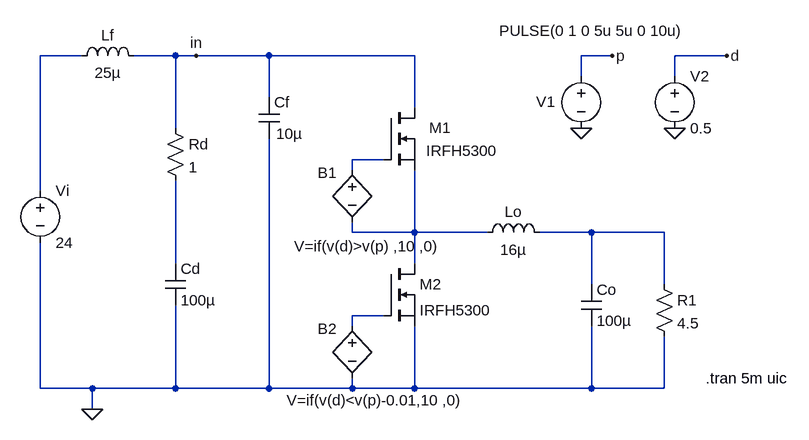
[diagram p0: schematic SyncBuck.asc]
SyncBuck.asc, the LTspice schematic file:
Version 4
SHEET 1 880 824
WIRE -1760 -320 -1824 -320
WIRE -1616 -320 -1680 -320
WIRE -1584 -320 -1616 -320
WIRE -1472 -320 -1584 -320
WIRE -1248 -320 -1472 -320
WIRE -944 -320 -992 -320
WIRE -768 -320 -848 -320
WIRE -992 -288 -992 -320
WIRE -848 -288 -848 -320
WIRE -1472 -256 -1472 -320
WIRE -1248 -240 -1248 -320
WIRE -1616 -208 -1616 -320
WIRE -1296 -160 -1344 -160
WIRE -1344 -144 -1344 -160
WIRE -1824 -112 -1824 -320
WIRE -1344 -48 -1344 -64
WIRE -1248 -48 -1248 -144
WIRE -1248 -48 -1344 -48
WIRE -1136 -48 -1248 -48
WIRE -976 -48 -1056 -48
WIRE -864 -48 -976 -48
WIRE -1616 0 -1616 -128
WIRE -1248 0 -1248 -48
WIRE -976 32 -976 -48
WIRE -864 32 -864 -48
WIRE -1296 80 -1344 80
WIRE -1344 96 -1344 80
WIRE -1824 192 -1824 -32
WIRE -1744 192 -1824 192
WIRE -1616 192 -1616 64
WIRE -1616 192 -1744 192
WIRE -1472 192 -1472 -192
WIRE -1472 192 -1616 192
WIRE -1344 192 -1344 176
WIRE -1344 192 -1472 192
WIRE -1248 192 -1248 96
WIRE -1248 192 -1344 192
WIRE -976 192 -976 96
WIRE -976 192 -1248 192
WIRE -864 192 -864 112
WIRE -864 192 -976 192
WIRE -1744 224 -1744 192
FLAG -1744 224 0
FLAG -992 -208 0
FLAG -944 -320 p
FLAG -848 -208 0
FLAG -768 -320 d
FLAG -1584 -320 in
SYMBOL ind -1776 -304 R270
WINDOW 0 32 56 VTop 2
WINDOW 3 5 56 VBottom 2
SYMATTR InstName Lf
SYMATTR Value 25µ
SYMBOL ind -1152 -32 R270
WINDOW 0 32 56 VTop 2
WINDOW 3 5 56 VBottom 2
SYMATTR InstName Lo
SYMATTR Value 16µ
SYMBOL cap -992 32 R0
SYMATTR InstName Co
SYMATTR Value 100µ
SYMBOL res -880 16 R0
SYMATTR InstName R1
SYMATTR Value 4.5
SYMBOL voltage -1824 -128 R0
WINDOW 123 0 0 Left 2
WINDOW 39 0 0 Left 2
SYMATTR InstName Vi
SYMATTR Value 24
SYMBOL cap -1632 0 R0
SYMATTR InstName Cd
SYMATTR Value 100µ
SYMBOL cap -1488 -256 R0
WINDOW 3 27 56 Left 2
SYMATTR Value 10µ
SYMATTR InstName Cf
SYMBOL res -1632 -224 R0
SYMATTR InstName Rd
SYMATTR Value 1
SYMBOL bv -1344 -160 R0
WINDOW 0 -53 20 Left 2
WINDOW 3 -89 133 Left 2
SYMATTR InstName B1
SYMATTR Value V=if(v(d)>v(p) ,10 ,0)
SYMBOL voltage -992 -304 R0
WINDOW 123 0 0 Left 2
WINDOW 39 0 0 Left 2
WINDOW 3 -126 -54 Left 2
WINDOW 0 -69 55 Left 2
SYMATTR Value PULSE(0 1 0 5u 5u 0 10u)
SYMATTR InstName V1
SYMBOL voltage -848 -304 R0
WINDOW 123 0 0 Left 2
WINDOW 39 0 0 Left 2
SYMATTR InstName V2
SYMATTR Value 0.5
SYMBOL nmos -1296 -240 R0
WINDOW 0 70 31 Left 2
WINDOW 3 66 66 Left 2
SYMATTR InstName M1
SYMATTR Value IRFH5300
SYMBOL nmos -1296 0 R0
SYMATTR InstName M2
SYMATTR Value IRFH5300
SYMBOL bv -1344 80 R0
WINDOW 0 -53 20 Left 2
WINDOW 3 -101 130 Left 2
SYMATTR InstName B2
SYMATTR Value V=if(v(d)<v(p)-0.01,10 ,0)
TEXT -800 176 Left 2 !.tran 5m uic

The netlist it stands for:
* SyncBuck.asc
Lf N001 in 25µ
Lo N003 N004 16µ
Co N004 0 100µ
R1 N004 0 4.5
Vi N001 0 24
Cd N005 0 100µ
Cf in 0 10µ
Rd in N005 1
B1 N002 N003 V=if(v(d)>v(p) ,10 ,0)
V1 p 0 PULSE(0 1 0 5u 5u 0 10u)
V2 d 0 0.5
M1 in N002 N003 N003 IRFH5300
M2 N003 N006 0 0 IRFH5300
B2 N006 0 V=if(v(d)<v(p)-0.01,10 ,0)
.model NMOS NMOS
.model PMOS PMOS
.lib standard.mos
.tran 5m uic
.backanno
.end